# Altium schematic sheet USB.SchDoc
size A4; SheetNumber: 5; SheetTotal: 5
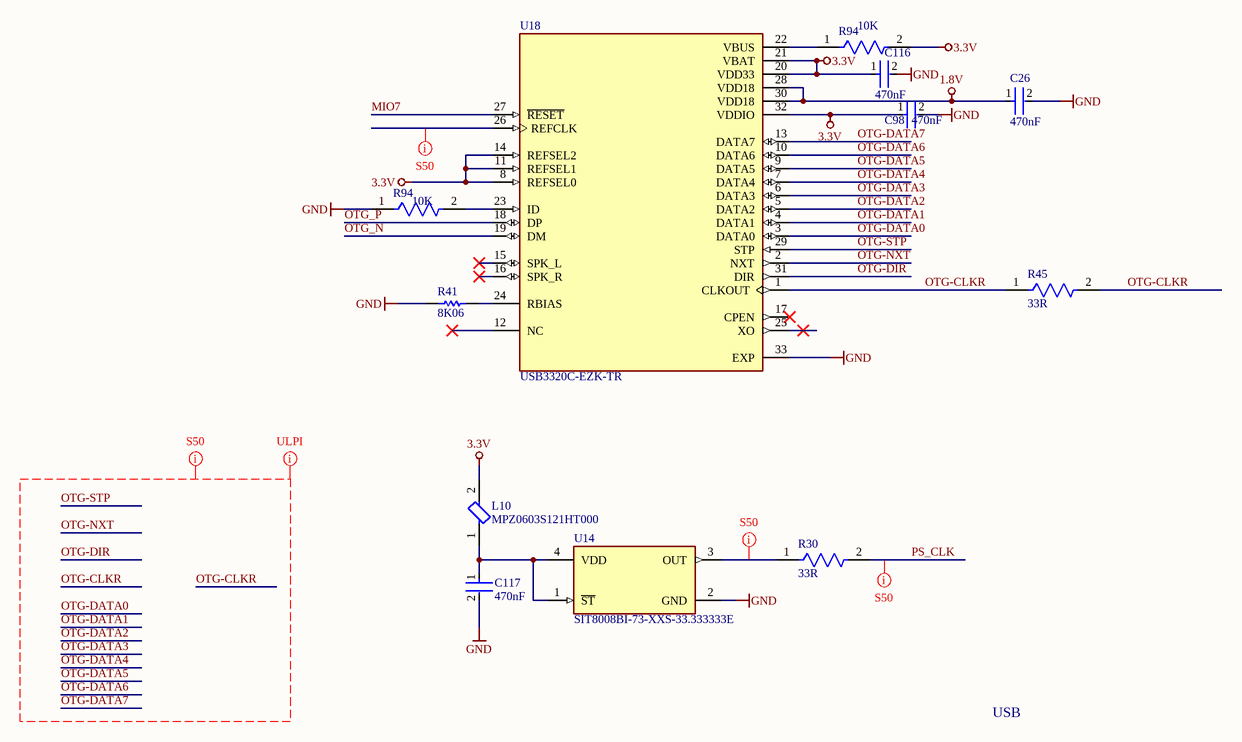
[diagram p0: USB.SchDoc]

## Parts
(Parts that share a designator on the sheet are numbered #1, #2 ... from top to bottom, then left to right.)
C26  470nF  [FP-GRM15-0_1-MFG]
C98  470nF  [FP-GRM15-0_1-MFG]
C116  470nF  [FP-GRM15-0_1-MFG]
C117  470nF  [FP-GRM15-0_1-MFG]
L10  MPZ0603S121HT000  [FP-MPZ0603-IPC_C]
R30  33R  [FP-AC0603-IPC_A]
R41  8K06  [RESC0603(1608)_N]
R45  33R  [FP-AC0603-IPC_A]
R94#1  10K  [FP-MCT0603-IPC_C]
R94#2  10K  [FP-MCT0603-IPC_C]
U14  SIT8008BI-73-XXS-33.333333E  [FP-SiT8008-7-MFG]
U18  USB3320C-EZK-TR  [QFN50P500X500X100-33N]

## Nets
1.8V: C26.1 U18.28(VDD18) U18.30(VDD18)
3.3V: C98.1 C116.1 L10.2 R94#1.2 U18.8(REFSEL0) U18.11(REFSEL1) U18.14(REFSEL2) U18.20(VDD33) U18.21(VBAT) U18.32(VDDIO)
GND: C26.2 C98.2 C116.2 C117.2 R41.1 R94#2.1 U14.2(GND) U18.33(EXP)
MIO7: U18.27(~{RESET})
OTG-CLKR: R45.1 R45.2 U18.1(CLKOUT)
OTG-DATA0: U18.3(DATA0)
OTG-DATA1: U18.4(DATA1)
OTG-DATA2: U18.5(DATA2)
OTG-DATA3: U18.6(DATA3)
OTG-DATA4: U18.7(DATA4)
OTG-DATA5: U18.9(DATA5)
OTG-DATA6: U18.10(DATA6)
OTG-DATA7: U18.13(DATA7)
OTG-DIR: U18.31(DIR)
OTG-NXT: U18.2(NXT)
OTG-STP: U18.29(STP)
OTG_N: U18.19(DM)
OTG_P: U18.18(DP)
PS_CLK: R30.2
NetC117_1: C117.1 L10.1 U14.1(~{ST}) U14.4(VDD)
NetR30_1: R30.1 U14.3(OUT)
NetR41_2: R41.2 U18.24(RBIAS)
NetR94#1_1: R94#1.1 U18.22(VBUS)
NetR94#2_2: R94#2.2 U18.23(ID)

Not connected (* = marked no-connect by the designer): U18 12(NC)* 15(SPK_L)* 16(SPK_R)* 17(CPEN)* 25(XO)* 26(REFCLK)

## Layout directives
mark named S50: NetR30_1, NetU18_26, OTG-CLKR, OTG-DATA0, OTG-DATA1, OTG-DATA2, OTG-DATA3, OTG-DATA4, OTG-DATA5, OTG-DATA6, OTG-DATA7, OTG-DIR, OTG-NXT, OTG-STP, PS_CLK
mark named ULPI: OTG-CLKR, OTG-DATA0, OTG-DATA1, OTG-DATA2, OTG-DATA3, OTG-DATA4, OTG-DATA5, OTG-DATA6, OTG-DATA7, OTG-DIR, OTG-NXT, OTG-STP

## Notes on the sheet
- USB

## Library data of the parts
C26 C98 C116 C117 = CMP-2000-05009-2: CAP CER 0.47UF 10V X5R 0402; Manufacturer: Murata Electronics North America; Manufacturer Part Number: GRM155R61A474KE15D; Temperature Coefficient: 15%; Material: Ceramic; Tolerance: 10%; Device Class L3: Ceramic Capacitors; ComponentLink2Description: Datasheet; ComponentLink2URL: https://search.murata.co.jp/Ceramy/image/img/A01X/G101/ENG/GRM155R61A474KE15-01A.pdf; Package: GRM15-0.1; Voltage Rating: 10V; Capacitance: 0.47uF; Category: Cap; Temperature Range High: +85°C; Temperature Range Low: -55°C; Height: 0.55mm; Device Class L2: Capacitors; Lead Free: Yes; Mouser Description: Multilayer Ceramic Capacitors MLCC - SMD/SMT 0402 0.47uF 10volts X5R 10%; Ipc Land Pattern Name: CAPC10050X50; Temperature Characteristic: X5R; Digikey Description: CAP CER 0.47UF 10V X5R 0402; Value: 0.47uF; Octopart: https://octopart.com/grm155r61a474ke15d-murata-196883; Automotive: No; Device Class L1: Passive Components; Temperature: -55°C to +85°C; RoHS: TRUE
L10 = CMP-08257-000447-1: CHIP BEADS FOR GENERAL SIGNAL LI; Max Current Rating: 1A; DC Resistance (DCR): 130mR; Number of Lines: 1; Min Operating Temperature: -55°C; Mount: Surface Mount; Case Code (Imperial): 0201; Case Code (Metric): 0603; Max Operating Temperature: 125°C; RoHS Compliant: Yes; Packaging: Cut Tape; Case/Package: 0201
R30 R45 = CMP-03412-036690-2: RES 33Ω 1.00% 0.1W 0603; Power Rating: 100mW; Tolerance: 1%; Voltage Rating: 50V; Temperature Coefficient: 100ppm/°C; Case/Package: 0603; Ratings: AEC-Q200; Number of Terminations: 2; Case Code (Imperial): 0603; RoHS Compliant: Yes; Max Operating Temperature: 155°C; Packaging: Tape and Reel; Series: AC; Height: 0.45mm; Resistance: 33R; Features: Moisture Resistant; Case Code (Metric): 1608; Length: 1.6mm; Width: 0.8mm; Resistor Type: Thick Film; Max Power Dissipation: 100mW; Min Operating Temperature: -55°C; Termination: SMD/SMT
R41 = CMP-1012-00612-1: 8K06 0.1W 1% 0603 (1608 Metric)  SMD; Value: 8060.00 Ohm; Case-EIA: 0603; Case-Metric: 1608; Technology: SMT; Power: 0.1 W; Tolerance: 1 %
R94#1 R94#2 = CMP-02407-000775-1: RES SMD 100 OHM 1% 1/8W 0603
U14 = CMP-25159-259459-1: MEMS OSC XO 33.333333MHZ H/LV-CM; Max Supply Current: 4.5mA; Frequency Stability: 50ppm; Packaging: Tape and Reel; Series: SIT8008B; Mount: Surface Mount; RoHS Compliant: Yes; Frequency: 33.333333MHz; Max Operating Temperature: 85°C; Case/Package: SMD/SMT; Min Operating Temperature: -40°C
U18 = USB3320C-EZK-TR: Microchip USB3320C-EZK-TR, USB Transceiver, USB 2.0, 1.8 V, 3.3 V, 32-Pin QFN | Microchip Technology Inc. USB3320C-EZK-TR; SnapEDA_Link: https://www.snapeda.com/parts/USB3320C-EZK-TR/Microchip/view-part/?ref=snap; Package: QFN-32 Microchip; Value: *; MF: Microchip; MP: USB3320C-EZK-TR; Check_prices: https://www.snapeda.com/parts/USB3320C-EZK-TR/Microchip/view-part/?ref=eda